# EasyEDA Pro project Buzzer Module.eprj

# Schematic BuzzerModule
Board Name: Board1; Create Date: 2025-07-20; Page Name: P1; Project Name: Buzzer Module; Schematic Name: Schematic1; Update Date: 2025-12-25; Company: m039; Drawn: Dmitry Mozgin; Page Size: A4; Version: V1.0
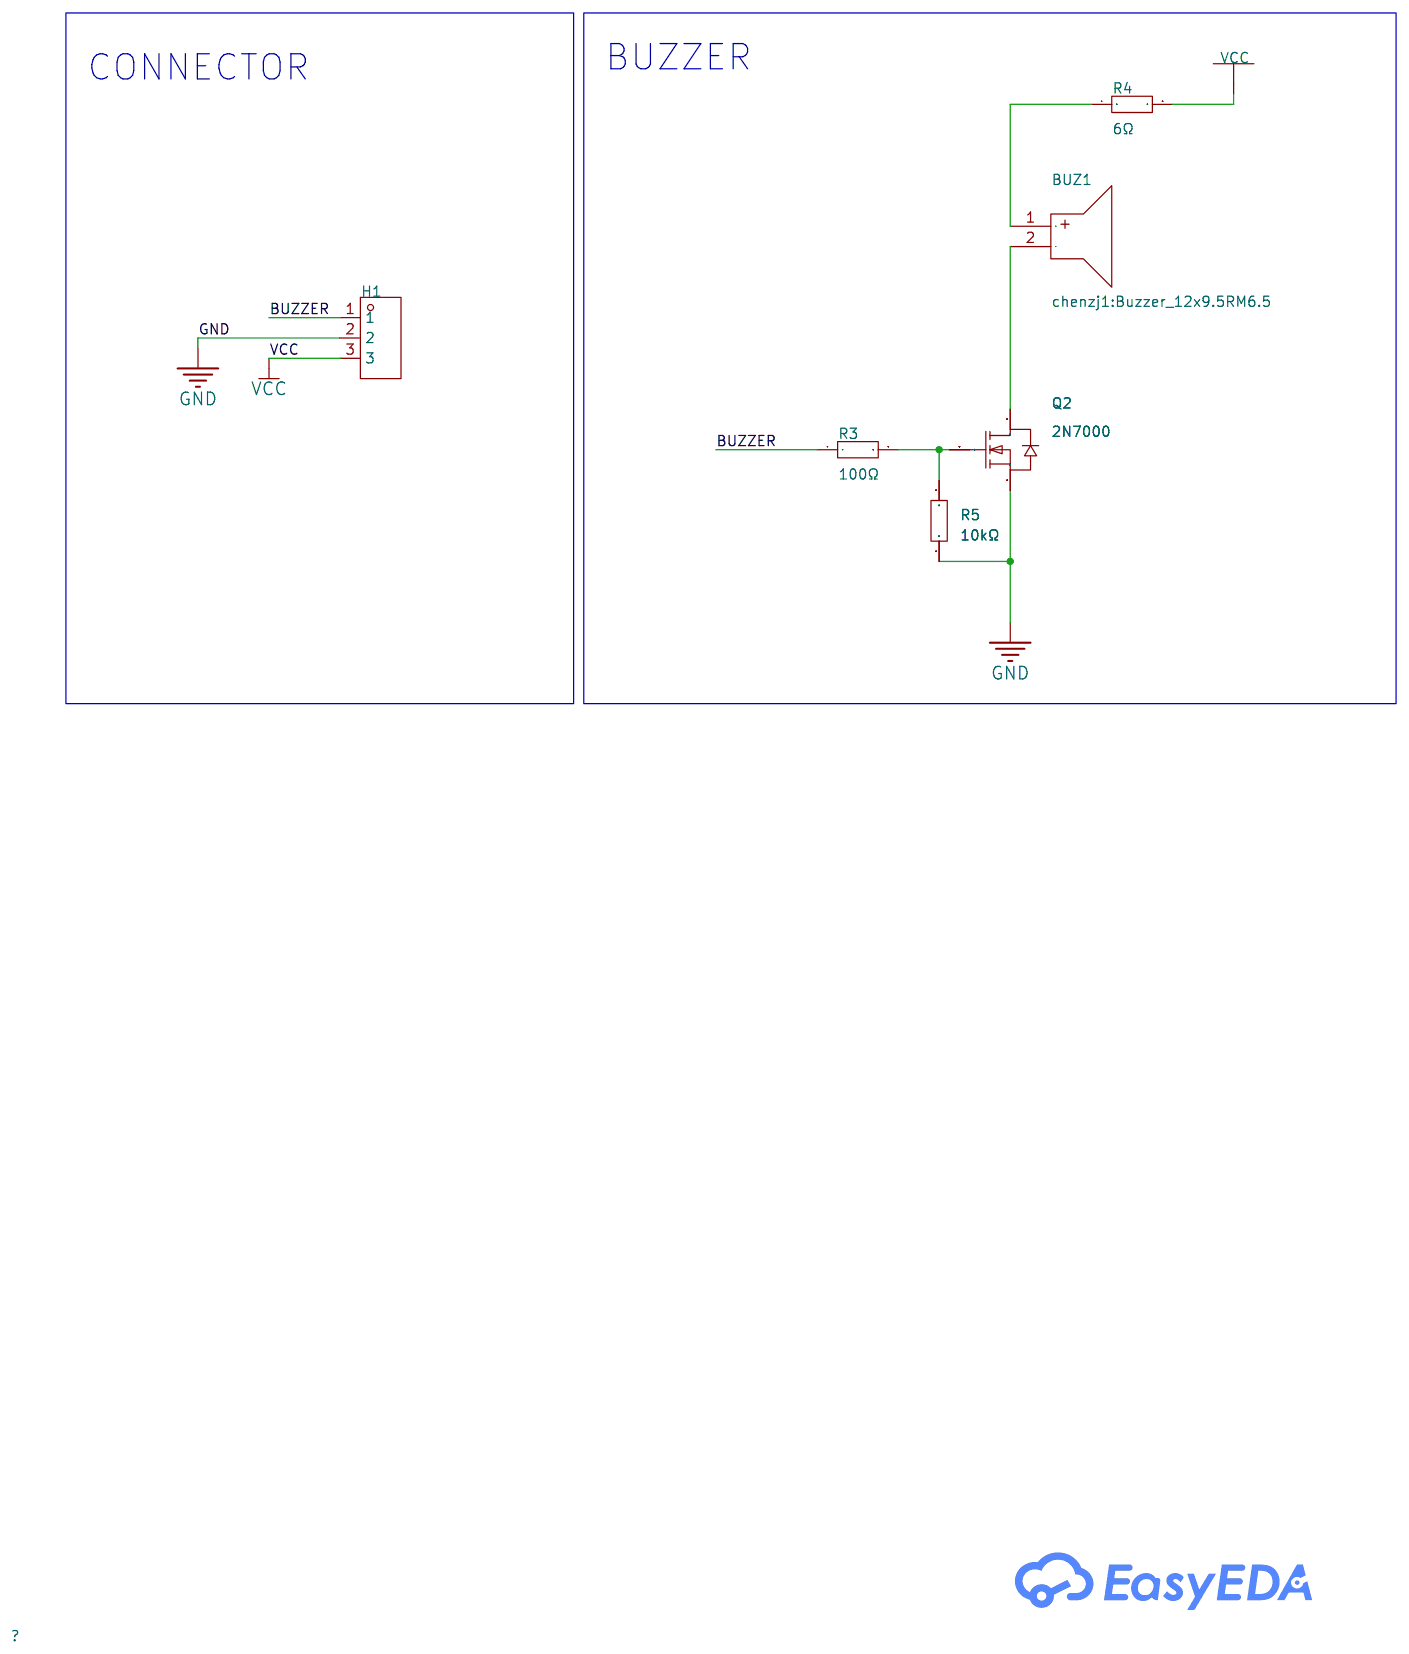
[diagram p0: schematic sheet]

## Parts
BUZ1  chenzj1:Buzzer_12x9.5RM6.5  [BUZ-TH_BD12.0-P6.50-D0.6_SEA-1285F]
H1  -  [HDR-TH_3P-P2.54-V-M]
Q2  2N7000  [TO-92-3_L4.9-W3.7-P1.27-L]
R3  100Ω  [RES-TH_BD1.8-L3.2-P7.20-D0.4]
R4  6Ω  [RES-TH_BD1.8-L3.2-P7.20-D0.4]
R5  10kΩ  [RES-TH_BD1.8-L3.2-P7.20-D0.4]

## Library data of the parts
BUZ1 = chenzj1:Buzzer_12x9.5RM6.5: Supplier Part: C9900008742; Supplier Footprint: Buzzer; JLCPCB Part Class: Extended Part; Supplier: LCSC
H1 = HDR-M_2.54_1x3P: Supplier Footprint: Through
Q2 = 2N7000_C3281848: LCSC Part Name: N沟道,电流:200mA,耐压:60V; Supplier Part: C3281848; Manufacturer: DIOTEC(德欧泰克); Supplier Footprint: TO-92; JLCPCB Part Class: Extended Part; Datasheet: https://atta.szlcsc.com/upload/public/pdf/source/20240403/5B509BF06D312B2EFF03B154576810C6.pdf; Supplier: LCSC; Type: 1 N-channel; RDS(on): 5Ω@10V,500mA; Gate Threshold Voltage (Vgs(th)@Id): 3V@1mA; Input Capacitance(Ciss@Vds): 60pF@25V; Reverse Transfer Capacitance (Crss@Vds): 5pF@25V; Operating Temperature: -55℃~+150℃
R3-R5 = Res_AXIAL-1/8W: Supplier Footprint: Through

## Nets
GND: H1.2 Q2.1(S) R5.1
VCC: H1.3 R4.2
BUZZER: H1.1 R3.1
$1N556: BUZ1.2(-) Q2.3(D)
$1N808: Q2.2(G) R3.2 R5.2
$1N1440: BUZ1.1(+) R4.1

## Notes on the sheet
- CONNECTOR
- BUZZER

# Board PCB1
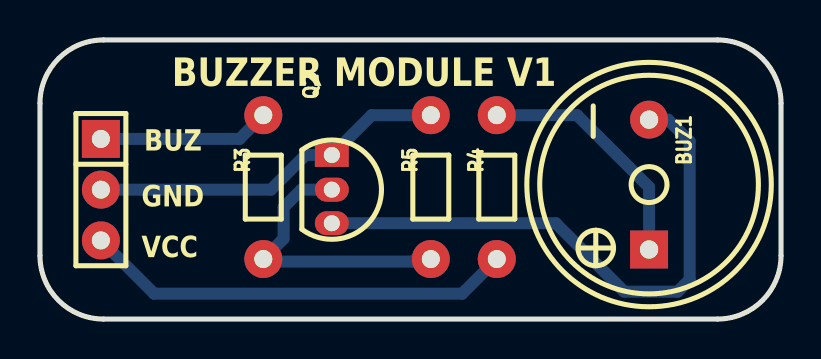
[diagram p1: board, top side]
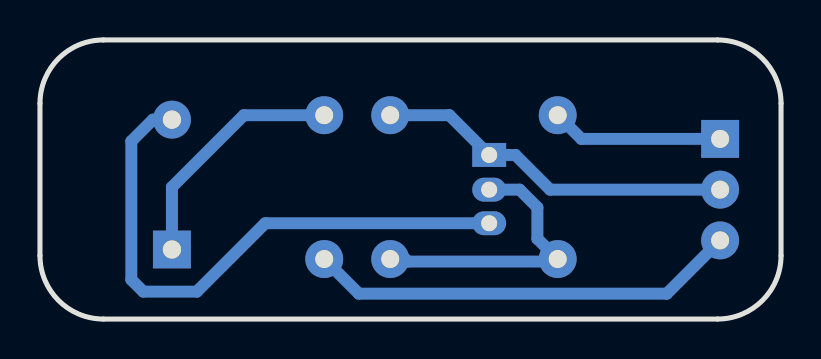
[diagram p2: board, bottom side, seen from below]

Outline 37.08 x 13.97 mm; copper layers: Top Layer, Bottom Layer. Coordinates in mm from the lower left corner of the outline.
Outline path: 0,10.8 0,3.17 arc(0.93,0.93) 3.18,0 33.91,0 arc(36.15,0.93) 37.08,3.17 37.08,10.8 arc(36.15,13.04) 33.91,13.97 3.18,13.97 arc(0.93,13.04) 0,10.8
Stack: Top Layer 0.035mm / Dielectric1 1.51mm FR4 er 4.5 / Bottom Layer 0.035mm

## Design rules (mm)
template: Custom Config
spacing copperThickness1oz (default): track to track 0.27, other pairs 0.152 to 0.3
spacing copperThickness2oz: track to track 0.203, other pairs 0.152 to 0.3
track width copperThickness1oz (default): min 0.127, default 0.6, max 2.54
track width copperThickness2oz: min 0.203, default 0.254, max 2.54
differential pair differentialPair (default): width min 0.127, default 0.254, max 2.54; gap min 0.152, default 0.152
via viaSize (default): diameter min 0.5, default 0.61, max 10; hole min 0.3, default 0.305, max 6.3

## Placement (name value [footprint] x y rotation side)
BUZ1  chenzj1:Buzzer_12x9.5RM6.5  [BUZ-TH_BD12.0-P6.50-D0.6_SEA-1285F]  30.48 6.73 90 top
H1  -  [HDR-TH_3P-P2.54-V-M]  3.05 6.48 270 top
Q2  2N7000  [TO-92-3_L4.9-W3.7-P1.27-L]  14.6 6.48 270 top
R3  100Ω  [RES-TH_BD1.8-L3.2-P7.20-D0.4]  11.18 6.6 270 top
R4  6Ω  [RES-TH_BD1.8-L3.2-P7.20-D0.4]  22.86 6.6 270 top
R5  10kΩ  [RES-TH_BD1.8-L3.2-P7.20-D0.4]  19.56 6.6 270 top

## Footprints (pads in the part's own frame, mm; a bottom-side part is the same pattern mirrored in y, then rotated)
BUZ-TH_BD12.0-P6.50-D0.6_SEA-1285F
  rect 1.9x1.9 hole 0.914x0.9: 1(-3.25,0)
  round 1.9 hole 0.914x0.9: 2(3.25,0)
HDR-TH_3P-P2.54-V-M
  rect 1.9x1.9 hole 0.9: 1(-2.54,0)
  round 1.9 hole 0.9: 2(0,0) 3(2.54,0)
RES-TH_BD1.8-L3.2-P7.20-D0.4
  round 1.9 hole 0.9: 1(-3.6,0) 2(3.6,0)
TO-92-3_L4.9-W3.7-P1.27-L
  rect 1.2x1.7 hole 0.8: 1(-1.736,0)
  oval 1.2x1.7 hole 0.8: 2(0,0) 3(1.681,0)

## Nets
As in the schematic.

## Routing (per net, layer and track width the routed paths; a pad name or vN(x,y) marks a point on that pad's centre or on a via; arc(x,y) is an arc through that point)
GND: length 18.1
  Bottom Layer w0.6: H1.2 11.56,6.48 13.29,8.21 14.6,8.21 16.6,10.2 R5.1
VCC: length 21.6
  Bottom Layer w0.6: H1.3 5.72,1.27 21.13,1.27 R4.2
BUZZER: length 8.6
  Bottom Layer w0.6: R3.1 9.99,9.02 3.05,9.02
$1N556: length 29
  Bottom Layer w0.6: Q2.3 25.81,4.8 29.24,1.37 31.91,1.37 32.51,1.97 32.51,8.9 31.43,9.98 BUZ1.2
$1N808: length 13.6
  Bottom Layer w0.6: 18.8,3 18.67,2.88 11.18,2.88 11.24,2.94 ; Q2.2 13.08,6.48 12.19,5.59 12.19,4.02 R3.2 ; 14.56,6.39 14.6,6.35
$1N1440: length 12.2
  Bottom Layer w0.6: BUZ1.1 30.48,6.6 26.88,10.2 R4.1

## Text on the board
Top Silkscreen Layer: GND | VCC | BUZ | BUZZER MODULE V1
